# Altium schematic sheet 1_P1.schdoc
size 429 x 307 mm; Symbol: Sheet-Symbol_A3; Device: Sheet-Symbol_A3; Company: 优程创客; Drawed: 优程; Reviewed: 创客; Version: V0.1; Page Size: A4; @Project Name: 蓝牙音响; @Page Count: 1; @Update Date: 2025-12-26; @Create Date: 2025-12-24; @Schematic Name: Schematic1; Part Number: JLCPCB-001; @Page No: 1; @Page Name: P1; @Board Name: Board1; @Create Time: 12:56:38; @Update Time: 00:12:36; Width: 1655; Height: 1170; Region Start: 1; X Region Count: 6; Y Region Count: 4; Blade Width: 10; Title Block Position: 3
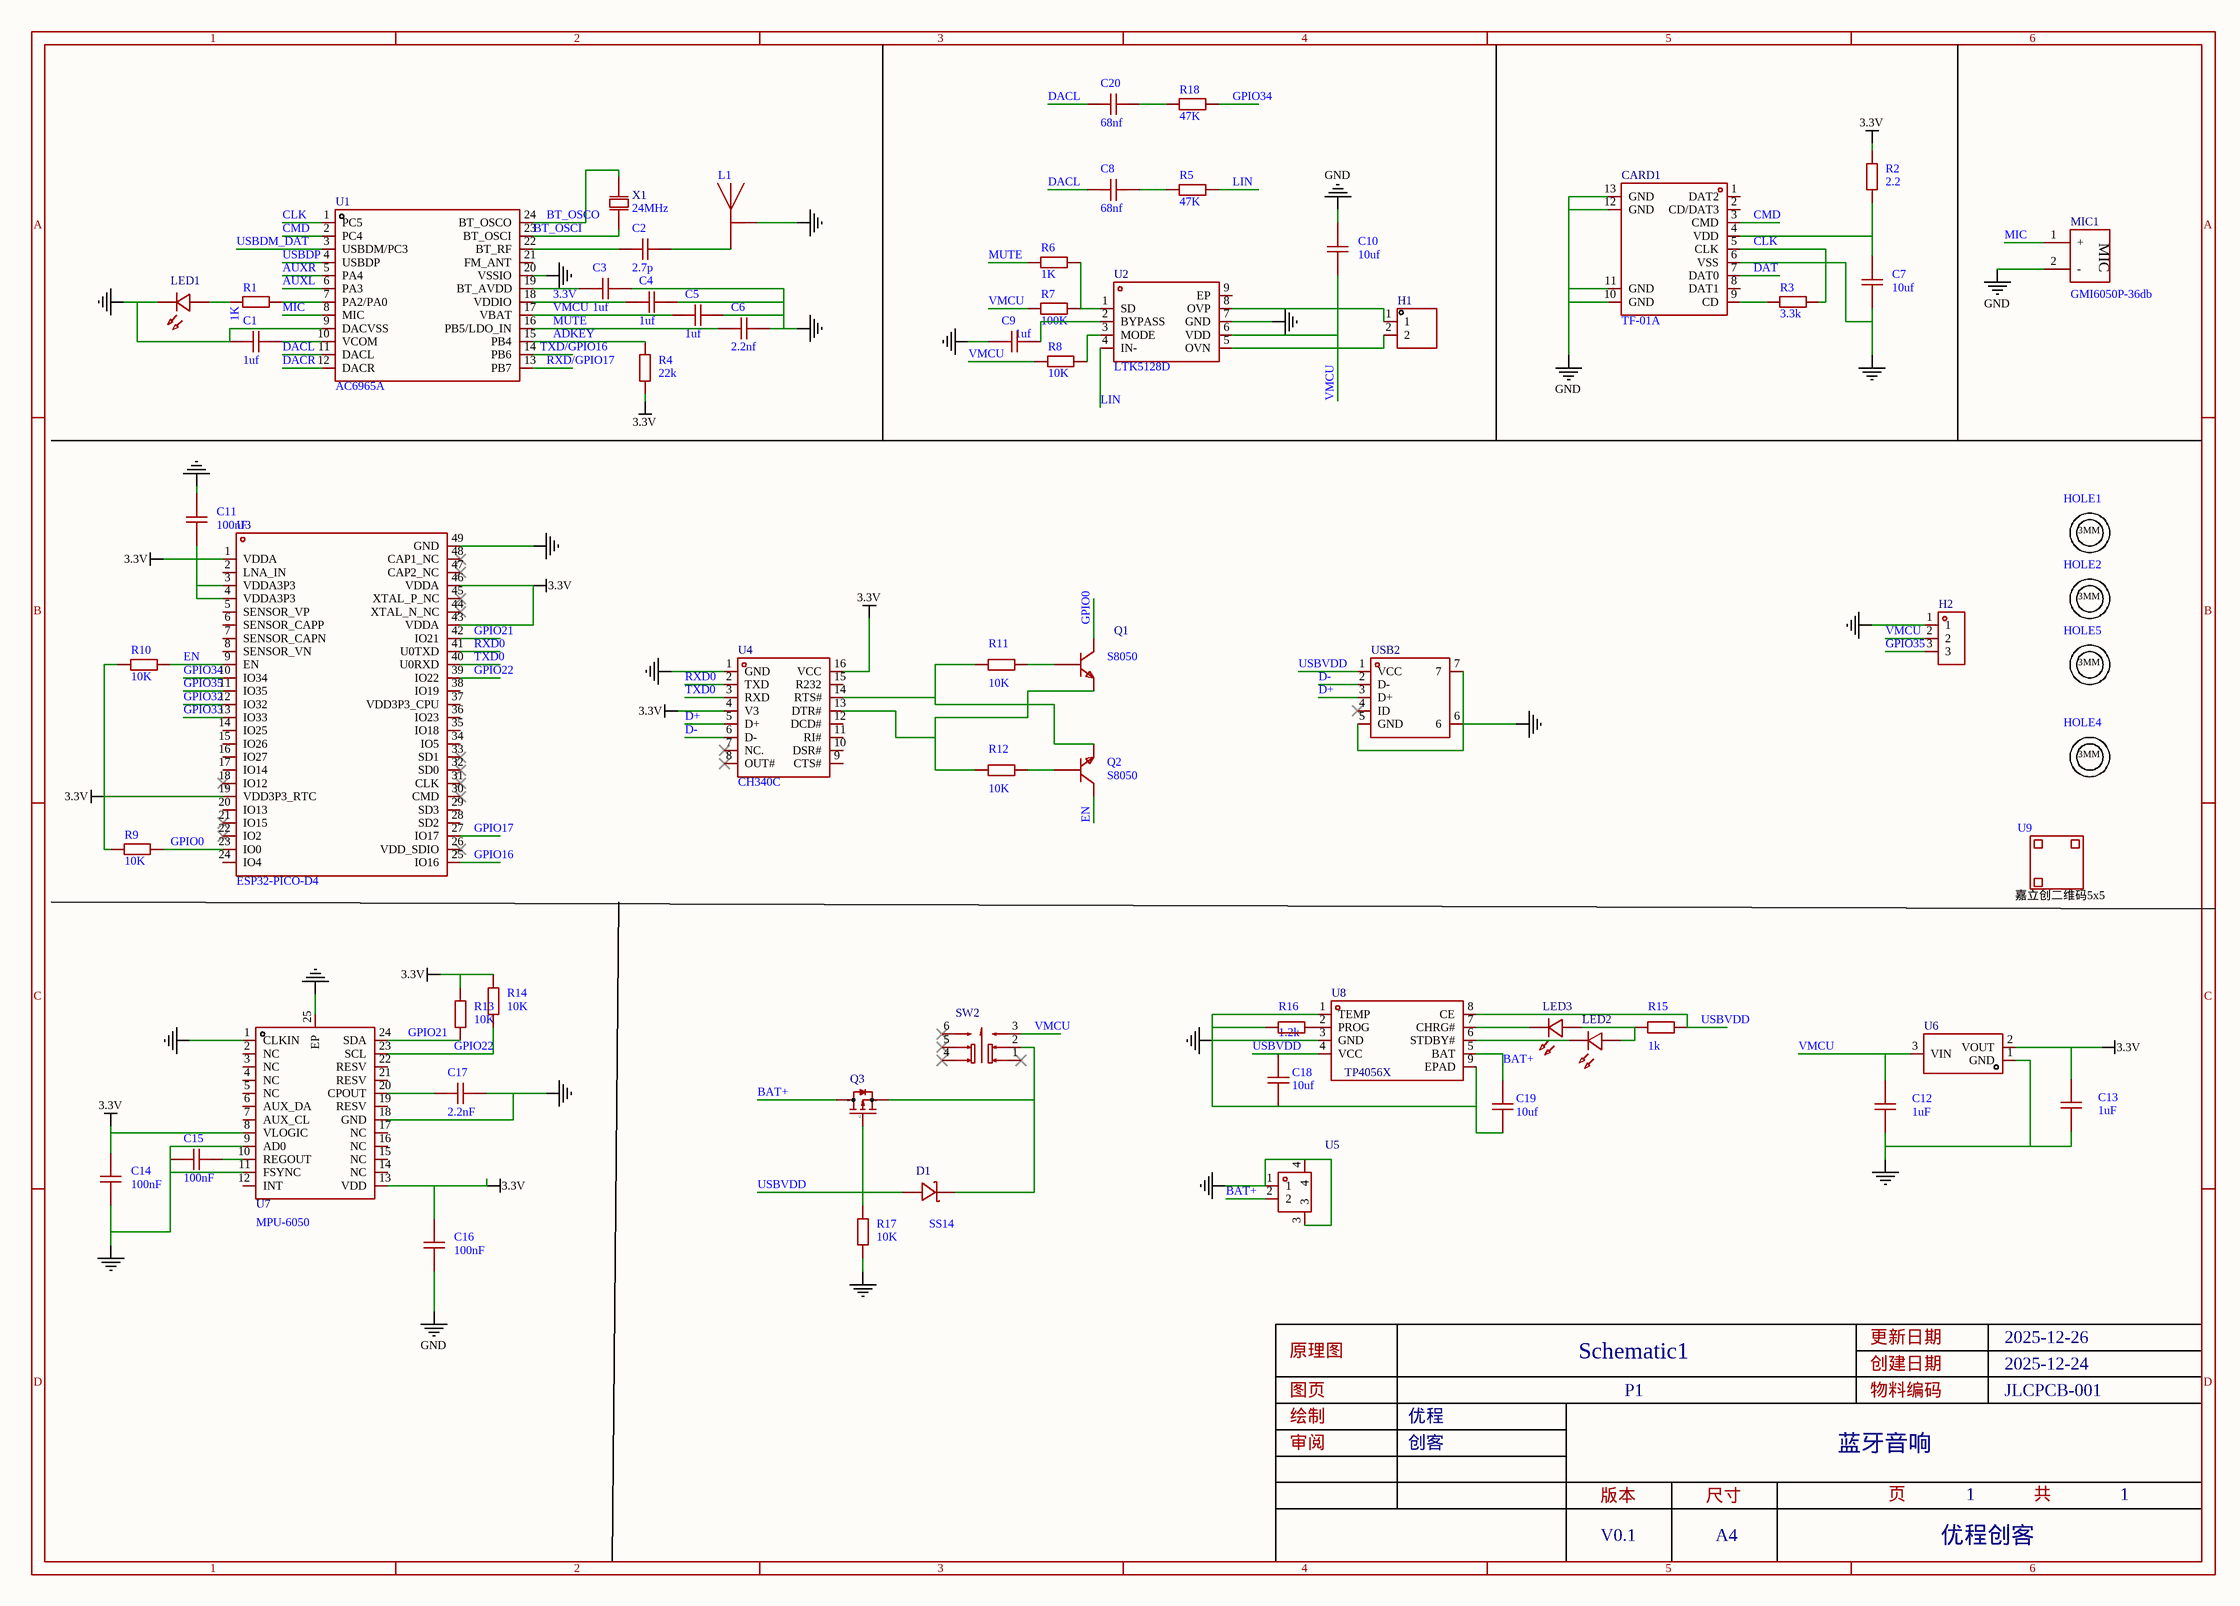
[diagram p0: 1_P1.schdoc]

## Parts
C1  1uf  [C0603]
C2  2.7p  [C0603]
C3  1uf  [C0603]
C4  1uf  [C0603]
C5  1uf  [C0603]
C6  2.2nf  [C0603]
C7  10uf  [C0603]
C8  68nf  [C0603]
C9  1uf  [C0603]
C10  10uf  [C0603]
C11  100nF  [C0603]
C12  1uF  [C0603]
C13  1uF  [C0603]
C14  100nF  [C0603]
C15  100nF  [C0603]
C16  100nF  [C0603]
C17  2.2nF  [C0603]
C18  10uf  [C0603]
C19  10uf  [C0603]
C20  68nf  [C0603]
CARD1  TF-01A  [TF-SMD_TF-02]
D1  SS14  [SMA_L4.2-W2.6-LS5.3-RD]
H1  (no value)  [HDR-TH_2P-P2.54-V-M-1]
H2  (no value)  [HDR-TH_3P-P2.54-V-M]
HOLE1  3MM螺丝孔  [3MM螺丝孔]  (value not drawn)
HOLE2  3MM螺丝孔  [3MM螺丝孔]  (value not drawn)
HOLE4  3MM螺丝孔  [3MM螺丝孔]  (value not drawn)
HOLE5  3MM螺丝孔  [3MM螺丝孔]  (value not drawn)
L1  (no value)  [2.4G天线-F]
LED1  (no value)  [LED_0603]
LED2  (no value)  [LED_0603]
LED3  (no value)  [LED_0603]
MIC1  GMI6050P-36db  [MIC-TH_BD6.0-P1.90-D0.4-L-FD_GMI6050P-2CXXDB]
Q1  S8050  [SOT-23-3_L2.9-W1.3-P1.90-LS2.4-BR]
Q2  S8050  [SOT-23-3_L2.9-W1.3-P1.90-LS2.4-BR]
Q3  NCE3401AY  [SOT-23_L2.9-W1.3-P1.90-LS2.4-BR]  (value not drawn)
R1  1K  [R0603]
R2  2.2  [R0603]
R3  3.3k  [R0603]
R4  22k  [R0603]
R5  47K  [R0603]
R6  1K  [R0603]
R7  100K  [R0603]
R8  10K  [R0603]
R9  10K  [R0603]
R10  10K  [R0603]
R11  10K  [R0603]
R12  10K  [R0603]
R13  10K  [R0603]
R14  10K  [R0603]
R15  1k  [R0603]
R16  1.2k  [R0603]
R17  10K  [R0603]
R18  47K  [R0603]
SW2  TK-6580D-2  [SW-TH_TK-6580D-2]  (value not drawn)
U1  AC6965A  [QSOP-24_L8.7-W3.9-P0.64-LS6.0-BL]
U2  LTK5128D  [ESOP-8_L4.9-W3.9-P1.27-LS6.0-BL-EP]
U3  ESP32-PICO-D4  [LGA-48_L7.0-W7.0-P0.50-BL-EP5.4]
U4  CH340C  [SOP-16_L10.0-W3.9-P1.27-LS6.0-BL]
U5  ZX-PH2.0-WT2P  [CONN-SMD_ZX-PH2.0-WT2P]  (value not drawn)
U6  TPMCP1700T-3302E/TT  [SOT-23-3_L2.9-W1.6-P1.90-LS2.8-BR]  (value not drawn)
U7  MPU-6050  [QFN-24_L4.0-W4.0-P0.50-BL-EP2.7]
U8  TP4056X  [SOP-8_L4.9-W3.9-P1.27-LS6.0-BL-EP]
U9  (no value)  [JLC-QRCODE-5x5]
USB2  KH-MINI-DIP180-5P-Cu  [USB-B-TH_KH-MINI-DIP180-5P-CU]  (value not drawn)
X1  24MHz  [OSC-SMD_L7.0-W4.1-LS7.6]

## Nets
3.3V: C4.1 C11.1 C13.2 C14.2 C16.2 R2.2 R4.2 R9.1 R10.1 R13.2 R14.2 U1.18(VDDIO) U3.1(VDDA) U3.3(VDDA3P3) U3.4(VDDA3P3) U3.19(VDD3P3_RTC) U3.43(VDDA) U3.46(VDDA) U4.4(V3) U4.16(VCC) U6.2(VOUT) U7.8(VLOGIC) U7.13(VDD)
GND: C1.1 C3.2 C4.2 C5.2 C6.2 C7.1 C9.1 C10.1 C11.2 C12.1 C13.1 C14.1 C15.1 C16.1 C17.2 C18.1 C19.1 CARD1.6(VSS) CARD1.10(GND) CARD1.11(GND) CARD1.12(GND) CARD1.13(GND) H2.1 L1.1 LED1.1(C) MIC1.2(-) R16.1 R17.1 U1.9(DACVSS) U1.20(VSSIO) U2.7(GND) U3.49(GND) U4.1(GND) U5.1 U5.3 U5.4 U6.1(GND) U7.1(CLKIN) U7.9(AD0) U7.11(FSYNC) U7.18(GND) U7.25(EP) U8.1(TEMP) U8.3(GND) U8.9(EPAD) USB2.5(GND) USB2.6 USB2.7
ADKEY: R4.1 U1.15(PB4)
AUXL: U1.6(PA3)
AUXR: U1.5(PA4)
BAT+: C19.2 Q3.3(D) U5.2 U8.5(BAT)
BT_OSCI: U1.23(BT_OSCI) X1.1(OSC1)
BT_OSCO: U1.24(BT_OSCO) X1.2(OSC2)
CLK: CARD1.5(CLK) R3.2 U1.1(PC5)
CMD: CARD1.3(CMD) U1.2(PC4)
D+: U4.5(D+) USB2.3(D+)
D-: U4.6(D-) USB2.2(D-)
DACL: C8.2 C20.2 U1.11(DACL)
DACR: U1.12(DACR)
DAT: CARD1.7(DAT0)
EN: Q2.3(C) R10.2 U3.9(EN)
GPIO0: Q1.3(C) R9.2 U3.23(IO0)
GPIO16: U3.25(IO16)
GPIO17: U3.27(IO17)
GPIO21: R13.1 U3.42(IO21) U7.24(SDA)
GPIO22: R14.1 U3.39(IO22) U7.23(SCL)
GPIO32: U3.12(IO32)
GPIO33: U3.13(IO33)
GPIO34: R18.2 U3.10(IO34)
GPIO35: H2.3 U3.11(IO35)
LIN: R5.2 U2.4(IN-)
MIC: MIC1.1(+) U1.8(MIC)
MUTE: C6.1 R6.1 U1.16(PB5/LDO_IN)
RXD0: U3.41(U0TXD) U4.2(TXD)
RXD/GPIO17: U1.13(PB7)
TXD0: U3.40(U0RXD) U4.3(RXD)
TXD/GPIO16: U1.14(PB6)
USBDM_DAT: U1.3(USBDM/PC3)
USBDP: U1.4(USBDP)
USBVDD: C18.2 D1.2(A) Q3.1(G) R15.2 R17.2 U8.4(VCC) U8.8(CE) USB2.1(VCC)
VMCU: C5.1 C10.2 C12.2 H2.2 R7.1 R8.1 SW2.3 U1.17(VBAT) U2.6(VDD) U6.3(VIN)
NetC1_2: C1.2 U1.10(VCOM)
NetC2_1: C2.1 U1.22(BT_RF)
NetC2_2: C2.2 L1.2
NetC3_1: C3.1 U1.19(BT_AVDD)
NetC7_2: C7.2 CARD1.4(VDD) R2.1
NetC8_1: C8.1 R5.1
NetC9_2: C9.2 U2.2(BYPASS)
NetC15_2: C15.2 U7.10(REGOUT)
NetC17_1: C17.1 U7.20(CPOUT)
NetC20_1: C20.1 R18.1
NetCARD1_9: CARD1.9(CD) R3.1
NetD1_1: D1.1(K) Q3.2(S) SW2.2
NetH1_1: H1.1 U2.8(OVP)
NetH1_2: H1.2 U2.5(OVN)
NetLED1_2: LED1.2(A) R1.1
NetLED2_1: LED2.1(C) U8.6(STDBY#)
NetLED2_2: LED2.2(A) LED3.2(A) R15.1
NetLED3_1: LED3.1(C) U8.7(CHRG#)
NetQ1_1: Q1.1(B) R11.2
NetQ1_2: Q1.2(E) R12.1 U4.13(DTR#)
NetQ2_1: Q2.1(B) R12.2
NetQ2_2: Q2.2(E) R11.1 U4.14(RTS#)
NetR1_2: R1.2 U1.7(PA2/PA0)
NetR6_2: R6.2 R7.2 U2.1(SD)
NetR8_2: R8.2 U2.3(MODE)
NetR16_2: R16.2 U8.2(PROG)

Not connected (* = marked no-connect by the designer): CARD1 1(DAT2) 2(CD/DAT3) 8(DAT1); SW2 1* 4* 5* 6*; U1 21(FM_ANT); U2 9(EP); U3 2(LNA_IN) 5(SENSOR_VP) 6(SENSOR_CAPP) 7(SENSOR_CAPN) 8(SENSOR_VN) 14(IO25) 15(IO26) 16(IO27) 17(IO14) 18(IO12)* 20(IO13) 21(IO15)* 22(IO2)* 24(IO4) 26(VDD_SDIO)* 28(SD2) 29(SD3) 30(CMD)* 31(CLK)* 32(SD0)* 33(SD1)* 34(IO5) 35(IO18) 36(IO23) 37(VDD3P3_CPU) 38(IO19) 44(XTAL_N_NC)* 45(XTAL_P_NC)* 47(CAP2_NC)* 48(CAP1_NC)*; U4 7(NC.)* 8(OUT#)* 9(CTS#) 10(DSR#) 11(RI#) 12(DCD#) 15(R232); U7 2(NC) 3(NC) 4(NC) 5(NC) 6(AUX_DA) 7(AUX_CL) 12(INT) 14(NC) 15(NC) 16(NC) 17(NC) 19(RESV) 21(RESV) 22(RESV); USB2 4(ID)*

## Notes on the sheet
- 1
- 2
- 3
- 4
- 5
- 6
- A
- B
- C
- 原理图
- Schematic1
- 创建日期
- 更新日期
- 2025-12-26
- 2025-12-24
- D
- 绘制
- 图页
- 优程
- P1
- 物料编码
- JLCPCB-001
- 审阅
- 创客
- 版本
- 尺寸
- 蓝牙音响
- 页
- 共
- V0.1
- A4
- 优程创客
- (in symbol 3MM螺丝孔) 3MM
- (in symbol GMI6050P-36db) MIC

## Library data of the parts
C1-C11 C14-C17 C20 = CAP_0603: Symbol: Capacitance; Convert to PCB: yes; Device: CAP_0603; Add into BOM: yes; Supplier Footprint: 0603
  C1 C3-C5 C9: Value: 1uf
  C2: Value: 2.7p
  C6: Value: 2.2nf
  C7 C10: Value: 10uf
  C8 C20: Value: 68nf
  C11 C14-C16: Value: 100nF
  C17: Value: 2.2nF
C12 C13 C18 C19 = CAP_0603: Symbol: CapAcitance; Convert to PCB: yes; Device: CAP_0603; Add into BOM: yes; Supplier Footprint: 0603
  C12 C13: Value: 1uF
  C18 C19: Value: 10uf
CARD1 = TF-01A_C2889258: Manufacturer: Yuandi(元迪); Add into BOM: yes; Card Connection Mode: 自弹式; Card Type: MicroSD卡(TF卡); Connector Type: 卡座; Symbol: TF-01A_C2889258; Device: TF-01A_C2889258; LCSC Part Name: 自弹式 MicroSD卡(TF卡) 卡座; Supplier Part: C2889258; Manufacturer Part: TF-01A; Supplier Footprint: SMD; JLCPCB Part Class: 扩展库; Datasheet: https://item.szlcsc.com/datasheet/TF-01A/3111798.html; Supplier: LCSC; Convert to PCB: yes; Height Above Board: 2mm; Operating Temperature: -
D1 = SS14_C2480: Manufacturer: MDD(辰达半导体); Add into BOM: yes; Diode Configuration: 独立式; Forward Voltage (Vf@If): 550mV@1A; Reverse Voltage (Vr): 40V; Rectified Current: 1A; Reverse Leakage Current (Ir): 300uA@40V; Symbol: SS14; Device: SS14_C2480; LCSC Part Name: 电压:40V 电流:1A; Supplier Part: C2480; Manufacturer Part: SS14; Supplier Footprint: SMA(DO-214AC); JLCPCB Part Class: 基础库; Datasheet: https://atta.szlcsc.com/upload/public/pdf/source/20240710/EF24798823EE33D63F154ED67BAC5E71.pdf; Supplier: LCSC; Convert to PCB: yes
H1 = HDR-M_2.54_1x2P: Symbol: 210S-1*2P L=11.6MMGold-plated black; Convert to PCB: yes; Device: HDR-M_2.54_1x2P; Add into BOM: yes; Supplier Part: C124375; Supplier Footprint: 插件
H2 = HDR-M_2.54_1x3P: Add into BOM: yes; Symbol: HDR-M_2.54_1x3P; Device: HDR-M_2.54_1x3P; Convert to PCB: yes; Supplier Part: C2937625; Supplier Footprint: 插件
HOLE1 HOLE2 HOLE4 HOLE5 = 3MM螺丝孔: Add into BOM: yes; Symbol: 3MM螺丝孔; Device: 3MM螺丝孔; Convert to PCB: yes
L1 = 2.4G天线: Add into BOM: yes; Symbol: 2.4G天线; Device: 2.4G天线; Convert to PCB: yes
LED1 LED3 = LED_0603-R: Symbol: LED_R; Convert to PCB: yes; Device: LED_0603-R; Add into BOM: yes; Supplier Footprint: 0603
LED2 = LED_0603-G: Symbol: LED_G; Convert to PCB: yes; Device: LED_0603-G; Add into BOM: yes; Supplier Footprint: 0603
MIC1 = GMI6050P-36db: Manufacturer: INGHAi(赢海); Add into BOM: yes; Symbol: GMI6050P-36DB; Device: GMI6050P-36db; LCSC Part Name: 全指向φ6.0*5.0mm 1.5V-10V 灵敏度-36db 低阻抗 针脚; Supplier Part: C233939; Manufacturer Part: GMI6050P-36db; Supplier Footprint: 插件,D=6mm; JLCPCB Part Class: 扩展库; Datasheet: https://atta.szlcsc.com/upload/public/pdf/source/20180613/C233951_CF3F103FE3546E5F8FCD1BC0597FF08F.pdf; Supplier: LCSC; Convert to PCB: yes
Q1 Q2 = S8050_C139514: Add into BOM: yes; Transistor Type: NPN; Collector Current (Ic): 500mA; Collector-Emitter Breakdown Voltage (Vceo): 25V; Power Dissipation (Pd): 300mW; Symbol: S8050_C139514; Device: S8050_C139514; LCSC Part Name: 耐压:25V 电流:500mA NPN; Supplier Part: C139514; Manufacturer Part: S8050; Supplier Footprint: SOT-23; JLCPCB Part Class: 扩展库; Datasheet: https://atta.szlcsc.com/upload/public/pdf/source/20171116/C139514_15108221321741123744.pdf; Supplier: LCSC; Convert to PCB: yes
Q3 = NCE3401AY: Manufacturer: NCE(无锡新洁能); Add into BOM: yes; Type: 1个P沟道; Drain to Source Voltage: 30V; Current - Continuous Drain(Id): 4.4A; RDS(on): 80mΩ@2.5V,1A; Pd - Power Dissipation: 1.3W; Gate Charge(Qg): 9.5nC@15V; Input Capacitance(Ciss@Vds): 950pF@15V; Reverse Transfer Capacitance (Crss@Vds): 75pF@15V; Symbol: NCE3401AY; Device: NCE3401AY; LCSC Part Name: 1个P沟道 耐压:30V 电流:4.4A; Supplier Part: C169815; Manufacturer Part: NCE3401AY; Supplier Footprint: SOT-23; JLCPCB Part Class: 扩展库; Datasheet: https://atta.szlcsc.com/upload/public/pdf/source/20201204/C169815_CFA12A4601FB437CD7968BD7EFA21584.pdf; Supplier: LCSC; Convert to PCB: yes; Gate Threshold Voltage (Vgs(th)@Id): -; Operating Temperature: -55℃~+150℃
R1-R18 = Res_0603: Symbol: 电阻; Convert to PCB: yes; Device: Res_0603; Add into BOM: yes; Supplier Footprint: 0603
  R1 R6: Value: 1K
  R2: Value: 2.2
  R3: Value: 3.3k
  R4: Value: 22k
  R5 R18: Value: 47K
  R7: Value: 100K
  R8-R14 R17: Value: 10K
  R15: Value: 1k
  R16: Value: 1.2k
SW2 = TK-6580D-2: Manufacturer: Yuandi(元迪); Add into BOM: yes; Circuit: 双刀双掷; Self Lock / No Lock: 无锁; Actuator Style: 方形按钮; Actuator/Cap Color: 白色; Pin Style: PC引脚; Operating Force: 180gf; Symbol: TK-6580D-2; Device: TK-6580D-2; Supplier: LCSC; Supplier Part: C528781; Manufacturer Part: TK-6580D-2; JLCPCB Part Class: 扩展库; LCSC Part Name: 5.8*5.8*7.3无声无锁短导平头插件双排6P按键开关DIP六脚; Supplier Footprint: 插件; Datasheet: https://atta.szlcsc.com/upload/public/pdf/source/20200831/C528780_B680ECD85D59BED6C2EC339047F2FA00.pdf; Convert to PCB: yes; Mounting Style: 直插; Mechanical Life: -
U1 = AC6965A: Add into BOM: yes; Symbol: AC6965A; Device: AC6965A; LCSC Part Name: AC6965A; Supplier Part: C5182264; Manufacturer Part: AC6965A; Supplier Footprint: QSOP-24; JLCPCB Part Class: 扩展库; Supplier: LCSC; Convert to PCB: yes
U2 = LTK5128D: Manufacturer: LTKCHIP(联辉科); Add into BOM: yes; Symbol: LTK5128D; Device: LTK5128D; LCSC Part Name: LTK5128D; Supplier Part: C406244; Manufacturer Part: LTK5128D; Supplier Footprint: ESOP-8; JLCPCB Part Class: 扩展库; Datasheet: https://item.szlcsc.com/datasheet/LTK5128D/394108.html; Supplier: LCSC; Convert to PCB: yes; Class: -; Output Power: -
U3 = ESP32-PICO-D4: Manufacturer: ESPRESSIF(乐鑫); Add into BOM: yes; Frequency Range: 2.412GHz~2.484GHz; Interface: I2C,SPI; Operating Voltage: 2.7V~3.6V; Output Power: 20dBm; Data Rate: 150Mbps; Sensitivity: -97dBm; Receive Current: 30mA; Typical Application Frequency: 2.4GHz; Symbol: ESP32-PICO-D4; Device: ESP32-PICO-D4; LCSC Part Name: 集成2.4GHz WIFI和蓝牙的模组; Supplier Part: C193707; Manufacturer Part: ESP32-PICO-D4; Supplier Footprint: QFN-48-EP(7x7); JLCPCB Part Class: 扩展库; Datasheet: https://atta.szlcsc.com/upload/public/pdf/source/20241030/D827B2F779C1E113D6FAEAB430963FEE.pdf; Supplier: LCSC; Convert to PCB: yes; Applications: IoT；WiFi；蓝牙; Current Of Transmitting: -; Operating Temperature: -40℃~+85℃
U4 = CH340C: Manufacturer: WCH(南京沁恒); Add into BOM: yes; Applications Function: 收发器; USB Protocol: USB 2.0; Voltage - Supply: 3.3V；5V; Data Rate: 2Mbps; Current - Supply: 7mA; Supply Current (Iq): 50uA; Symbol: CH340C; Device: CH340C; LCSC Part Name: USB转串口芯片; Supplier Part: C84681; Manufacturer Part: CH340C; Supplier Footprint: SOP-16; JLCPCB Part Class: 扩展库; Datasheet: https://item.szlcsc.com/datasheet/CH340C/85852.html; Supplier: LCSC; Convert to PCB: yes; Operating Temperature: -20℃~+70℃
U5 = ZX-PH2.0-WT2P: Manufacturer: Megastar(兆星); Add into BOM: yes; Pins Structure: 1x2P; Pitch: 2mm; Reference Series: PH; Number of PINs Per Row: 2; Supplementary Features: 辅助焊脚; Z-Height of the Board: 5.6mm; X-Length of Bottom Edge on Board (Spacing Line): 8mm; Y-Width of Bottom Edge on Board: 8.5mm; Symbol: ZX-PH2.0-WT2P; Device: ZX-PH2.0-WT2P; LCSC Part Name: 1x2P 间距:2mm 卧贴 系列:PH 配套胶壳型号：ZX-PH2.0-2PJK 配套端子型号：ZX-PH2.0-DZ 配套杜邦线型号：ZX-PH2.0-2PBXC; Supplier Part: C7429689; Manufacturer Part: ZX-PH2.0-WT2P; Supplier Footprint: SMD,P=2mm,卧贴; JLCPCB Part Class: Extended Part; Datasheet: https://atta.szlcsc.com/upload/public/pdf/source/20230619/22F856A07318150DB50BEAE33DC9B491.pdf; Supplier: LCSC; Convert to PCB: yes; Mounting Style: 卧贴; Number of Pins: 2P; Number of Rows: 1; Row Spacing: -; Current Rating (Max): -; Contact Material: 黄铜; Contact Plating: 锡; Operating Temperature Range: -; Rated Voltage (Max): -; Plastic Material: -; Flame Retardant Rating: -; Colour: 米色
U6 = TPMCP1700T-3302E/TT: Manufacturer: TECH PUBLIC(台舟); Add into BOM: yes; Output Type: 固定; Voltage - Supply: 6.5V; Output Voltage: 3.3V; Output Current: 450mA; Power Supply Rejection Ratio (PSRR): 40dB@(1kHz); Output Configuration: 正极; Number of Outputs: 1; Symbol: TPMCP1700T-3302E/TT; Device: TPMCP1700T-3302E/TT; LCSC Part Name: TPMCP1700T-3302E/TT; Supplier Part: C3021127; Manufacturer Part: TPMCP1700T-3302E/TT; Supplier Footprint: SOT-23L; JLCPCB Part Class: 扩展库; Datasheet: https://atta.szlcsc.com/upload/public/pdf/source/20220715/E589C7B11F1B7609A69E65A5BE7112D5.pdf; Supplier: LCSC; Convert to PCB: yes; Operating Temperature: -40℃~+125℃@(Tj)
U7 = MPU-6050: Manufacturer: TDK InvenSense(应美盛); Symbol: MPU-6050_C24112; Add into BOM: yes; Sensor Type: 加速度计陀螺仪; Device: MPU-6050; LCSC Part Name: MPU-6050; Supplier Part: C24112; Manufacturer Part: MPU-6050; Supplier Footprint: QFN-24-EP(4x4); JLCPCB Part Class: 扩展库; Datasheet: https://item.szlcsc.com/datasheet/MPU-6050/24852.html; Supplier: LCSC; Convert to PCB: yes; Operating Temperature: -40℃~+85℃
U8 = TP4056X: Manufacturer: TOPPOWER(南京拓微); Add into BOM: yes; Symbol: TP4056X; Device: TP4056X; LCSC Part Name: TP4056X; Supplier Part: C191323; Manufacturer Part: TP4056X; Supplier Footprint: SOP-8-EP; JLCPCB Part Class: 扩展库; Datasheet: https://atta.szlcsc.com/upload/public/pdf/source/20180424/C191323_1370BE5C4DD73DE4435E0781559DEFAC.pdf; Supplier: LCSC; Convert to PCB: yes
U9 = 嘉立创二维码5x5: Add into BOM: yes; Symbol: 嘉立创二维码5x5; Device: 嘉立创二维码5x5; Convert to PCB: yes
USB2 = KH-MINI-DIP180-5P-Cu: Manufacturer: kinghelm(金航标); Add into BOM: yes; Connector Type: Mini-B; Gender: 母; Number of Ports: 1; Number of Contacts: 5P; Symbol: KH-MINI-DIP180-5P-CU; Device: KH-MINI-DIP180-5P-Cu; LCSC Part Name: Mini-B 母 直插; Supplier Part: C2688798; Manufacturer Part: KH-MINI-DIP180-5P-Cu; Supplier Footprint: 插件; JLCPCB Part Class: 扩展库; Datasheet: https://atta.szlcsc.com/upload/public/pdf/source/20210203/C2688798_B00949A2762AD532187F9CA6575A989A.pdf; Supplier: LCSC; Convert to PCB: yes; Standard: USB 2.0; Mounting Style: 直插; Current Rating - Power (Max): -; Contact Material: -; Contact Plating: -; Operating Temperature Range: -; Soldering Temperature(Max): -
X1 = M49SAT24000121060: Manufacturer: JGHC(晶光华); Add into BOM: yes; Crystal Type: 贴片晶振; Normal temperature Frequency Tolerance: ±10ppm; External load capacitor: 12pF; Equivalent Series Resistance (ESR): 60Ω; Symbol: M49SAT24000121060; Device: M49SAT24000121060; LCSC Part Name: 24MHz ±10ppm 12pF; Supplier Part: C390761; Manufacturer Part: M49SAT24000121060; Supplier Footprint: HC-49S-SMD-2P-Mini; JLCPCB Part Class: 扩展库; Datasheet: https://atta.szlcsc.com/upload/public/pdf/source/20191012/C390762_A34054B777E2F33353B6DF635401005A.pdf; Supplier: LCSC; Convert to PCB: yes; Value: 24MHz; Operating Temperature: -40℃~+85℃